# Altium project 2023无人机分电板V2.PrjPcb
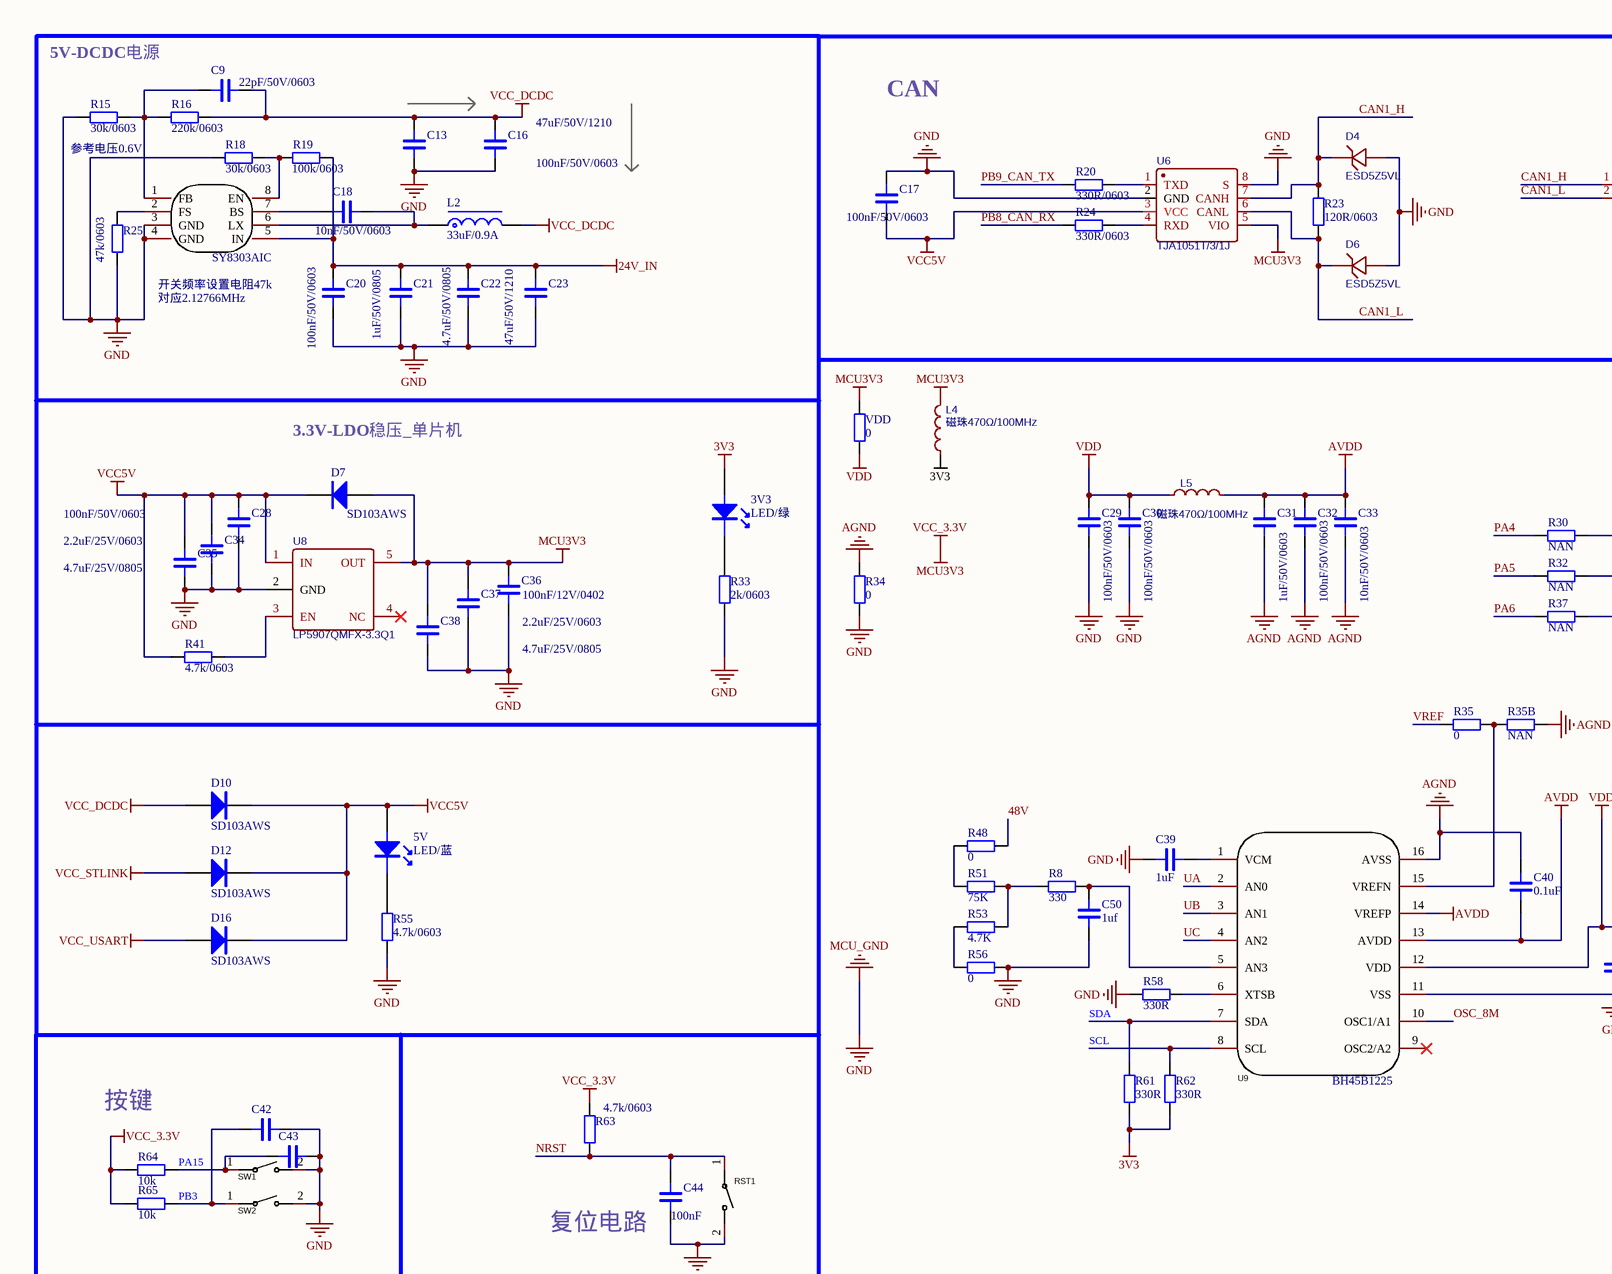
[diagram p0: MCU.SchDoc, top left]
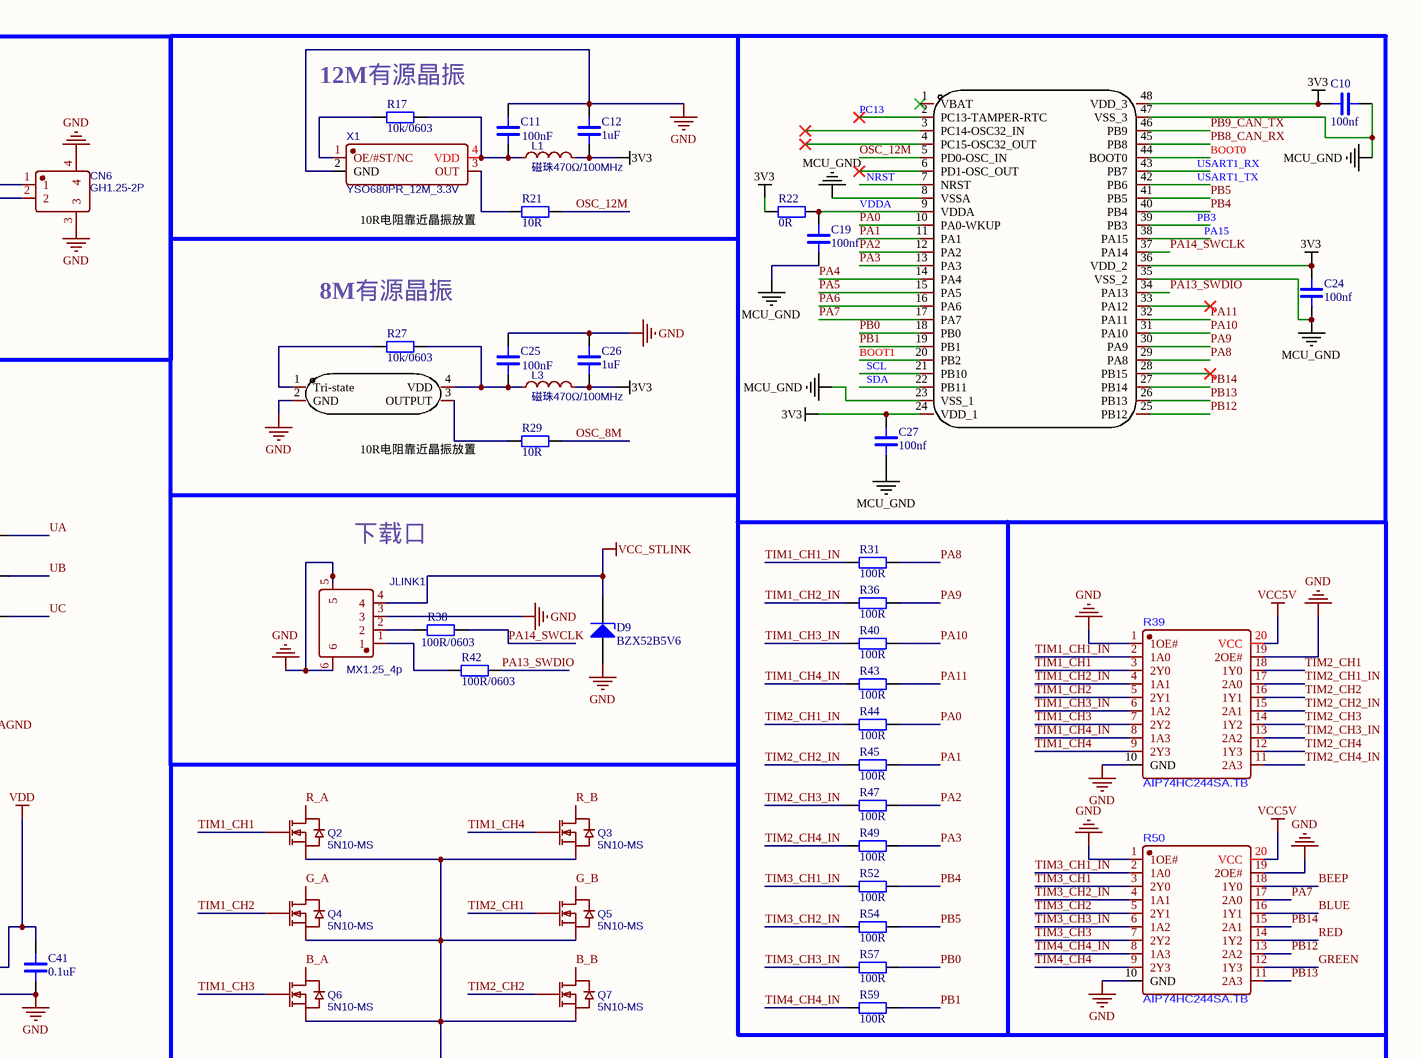
[diagram p1: MCU.SchDoc, top right]
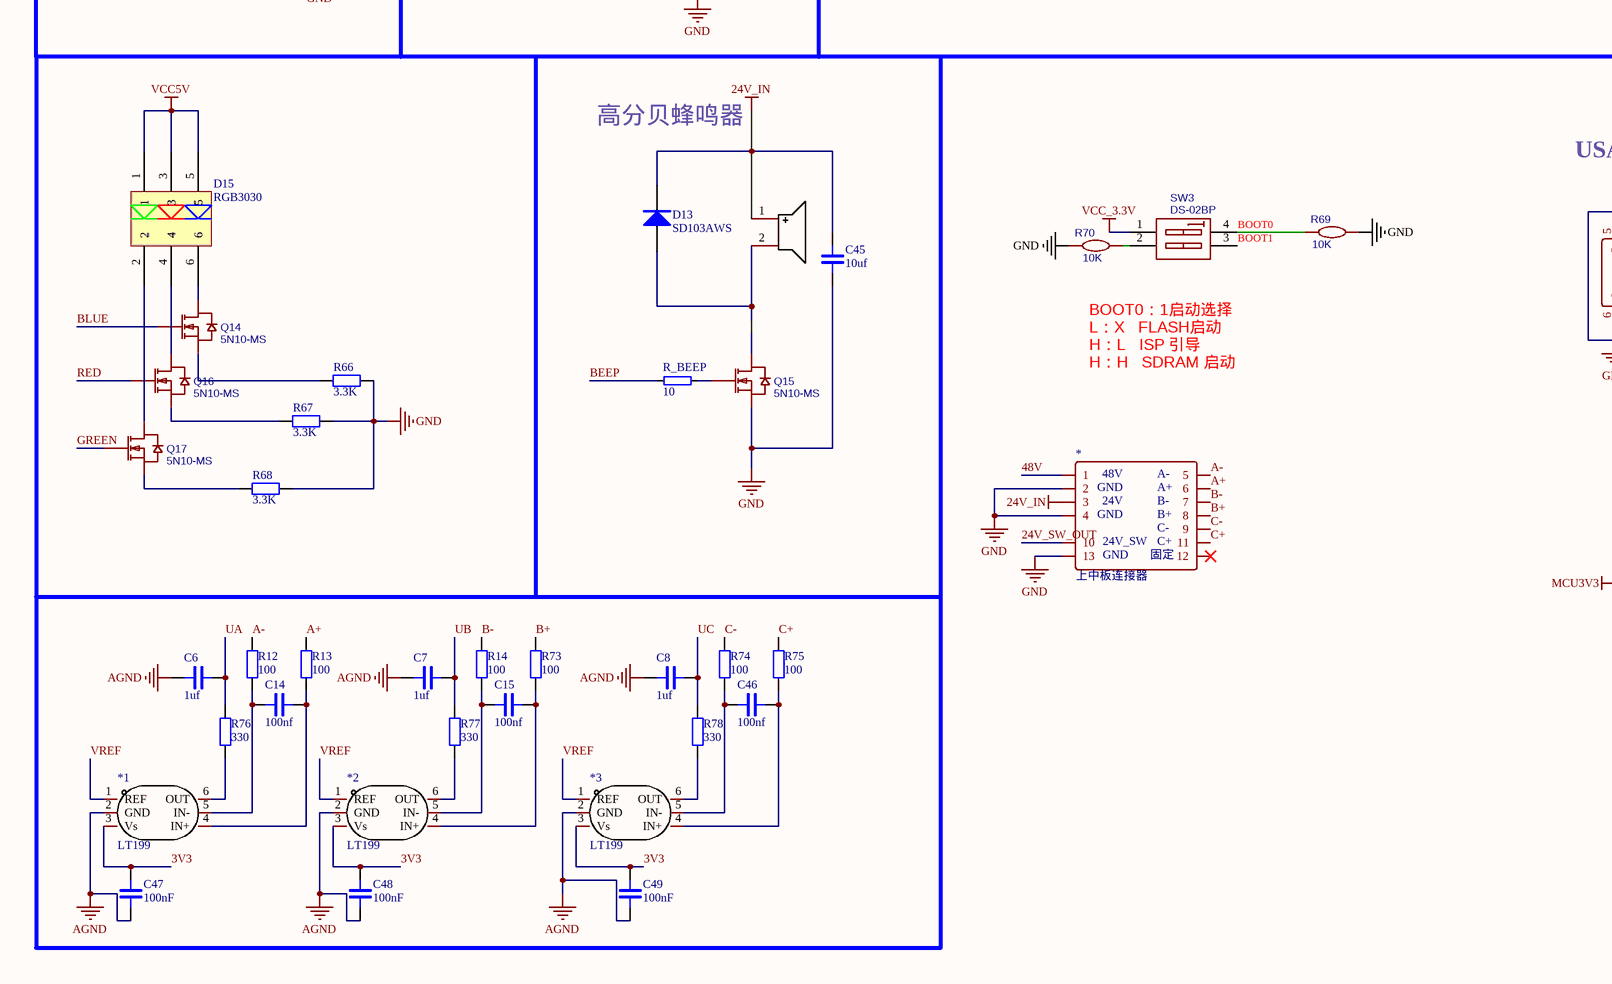
[diagram p2: MCU.SchDoc, bottom left]
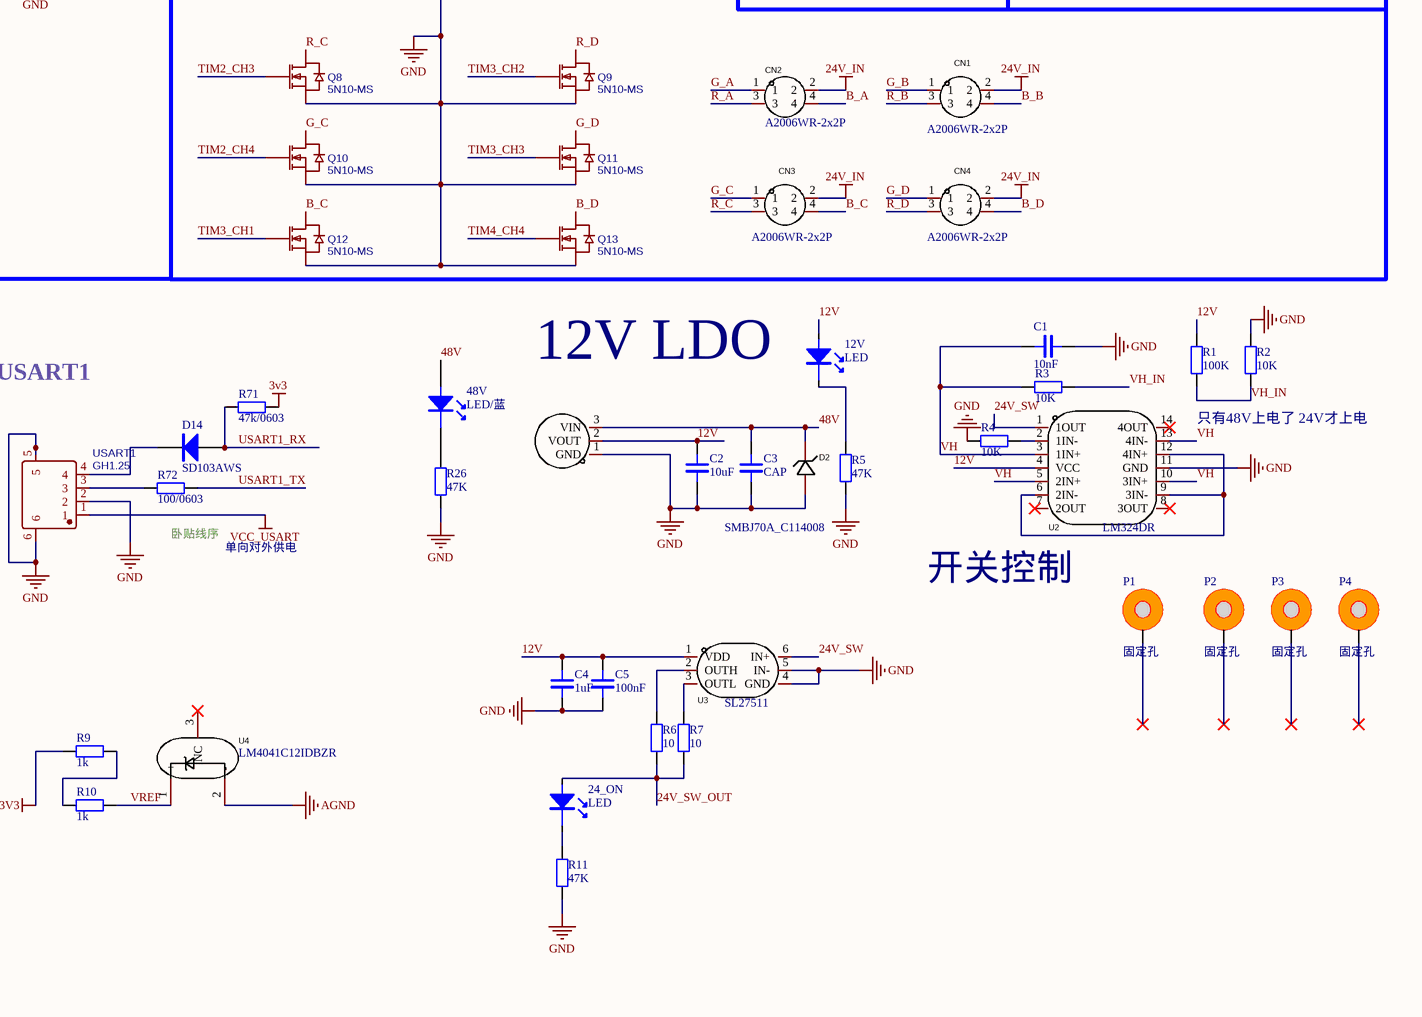
[diagram p3: MCU.SchDoc, bottom right]
1 sheet, 196 parts. Net scope: global (net labels, ports and power ports of the same name join across sheets).
Board file: 分电板V2.PcbDoc

## Sheet MCU.SchDoc
size A1

### Parts
3V3  LED/绿  [LED_0603]
5V  LED/蓝  [LED_0603]
12V  LED  [LED_0603]
24_ON  LED  [LED_0603]
48V  LED/蓝  [LED_0603]
*  上中板连接器  [上中板连接器]
*1  LT199  [SC70-6L]
*2  LT199  [SC70-6L]
*3  LT199  [SC70-6L]
BUZZER1  TMB12A12  [BUZ-TH_BD12.0-P7.60-D0.6-FD]  (value not drawn)
C1  10nF  [C 0603_L]
C2  10uF  [C 0603_L]
C3  CAP  [C 1210_L]
C4  1uF  [C 0603_L]
C5  100nF  [C 0603_L]
C6  1uf  [C 0603_L]
C7  1uf  [C 0603_L]
C8  1uf  [C 0603_L]
C9  22pF/50V/0603  [C 0603_L]
C10  100nf  [C 0603_L]
C11  100nF  [C 0603_L]
C12  1uF  [C 0603_L]
C13  47uF/50V/1210  [C 1210_L]
C14  100nf  [C 0603_L]
C15  100nf  [C 0603_L]
C16  100nF/50V/0603  [C 0603_L]
C17  100nF/50V/0603  [C 0603_L]
C18  10nF/50V/0603  [C 0603_L]
C19  100nf  [C 0603_L]
C20  100nF/50V/0603  [C 0603_L]
C21  1uF/50V/0805  [C 0805_L]
C22  4.7uF/50V/0805  [C 0805_L]
C23  47uF/50V/1210  [C 1210_L]
C24  100nf  [C 0603_L]
C25  100nF  [C 0603_L]
C26  1uF  [C 0603_L]
C27  100nf  [C 0603_L]
C28  100nF/50V/0603  [C 0603_L]
C29  100nF/50V/0603  [C 0603_L]
C30  100nF/50V/0603  [C 0603_L]
C31  1uF/50V/0603  [C 0603_L]
C32  100nF/50V/0603  [C 0603_L]
C33  10nF/50V/0603  [C 0603_L]
C34  2.2uF/25V/0603  [C 0603_L]
C35  4.7uF/25V/0805  [C 0805_L]
C36  100nF/12V/0402  [C 0603_L]
C37  2.2uF/25V/0603  [C 0603_L]
C38  4.7uF/25V/0805  [C 0805_L]
C39  1uF  [C 0603_L]
C40  0.1uF  [C 0603_L]
C41  0.1uF  [C 0603_L]
C42  100nF  [C 0603_L]  (value not drawn)
C43  100nF  [C 0603_L]  (value not drawn)
C44  100nF  [C 0603_L]
C45  10uf  [C 0805_L]
C46  100nf  [C 0603_L]
C47  100nF  [C 0603_L]
C48  100nF  [C 0603_L]
C49  100nF  [C 0603_L]
C50  1uf  [C 0603_L]
CN1  A2006WR-2x2P  [CONN-TH_A2006WR-2X2P]
CN2  A2006WR-2x2P  [CONN-TH_A2006WR-2X2P]
CN3  A2006WR-2x2P  [CONN-TH_A2006WR-2X2P]
CN4  A2006WR-2x2P  [CONN-TH_A2006WR-2X2P]
CN6  GH1.25-2P  [GH1.25-2P-LT]
D2  SMBJ70A_C114008  [SMB_L4.6-W3.6-LS5.3-RD]
D4  ESD5Z5VL  [SOD-523]
D6  ESD5Z5VL  [SOD-523]
D7  SD103AWS  [SOD-323]
D9  BZX52B5V6  [SOD-323]
D10  SD103AWS  [SOD-323]
D12  SD103AWS  [SOD-323]
D13  SD103AWS  [SOD-323]
D14  SD103AWS  [SOD-323]
D15  RGB3030  [LED-SMD_L3.0-W3.0_C9900015600]
D16  SD103AWS  [SOD-323]
JLINK1  MX1.25_4p  [MX1.25_4PIN]
L1  磁珠470Ω/100MHz  [L 0603]
L2  33uF/0.9A  [IND-SMD_L4.0-W4.0]
L3  磁珠470Ω/100MHz  [L 0603]
L4  磁珠470Ω/100MHz  [L 0603]
L5  磁珠470Ω/100MHz  [L 0603]
P1  固定孔  [固定孔]
P2  固定孔  [固定孔]
P3  固定孔  [固定孔]
P4  固定孔  [固定孔]
Q2  5N10-MS  [SOT23-3N]
Q3  5N10-MS  [SOT23-3N]
Q4  5N10-MS  [SOT23-3N]
Q5  5N10-MS  [SOT23-3N]
Q6  5N10-MS  [SOT23-3N]
Q7  5N10-MS  [SOT23-3N]
Q8  5N10-MS  [SOT23-3N]
Q9  5N10-MS  [SOT23-3N]
Q10  5N10-MS  [SOT23-3N]
Q11  5N10-MS  [SOT23-3N]
Q12  5N10-MS  [SOT23-3N]
Q13  5N10-MS  [SOT23-3N]
Q14  5N10-MS  [SOT23-3N]
Q15  5N10-MS  [SOT23-3N]
Q16  5N10-MS  [SOT23-3N]
Q17  5N10-MS  [SOT23-3N]
R1  100K  [R 0603_L]
R2  10K  [R 0603_L]
R3  10K  [R 0603_L]
R4  10K  [R 0603_L]
R5  47K  [R 0603_L]
R6  10  [R 0603_L]
R7  10  [R 0603_L]
R8  330  [R 0603_L]
R9  1k  [R 0603_L]
R10  1k  [R 0603_L]
R11  47K  [R 0603_L]
R12  100  [R 0603_L]
R13  100  [R 0603_L]
R14  100  [R 0603_L]
R15  30k/0603  [R 0603_L]
R16  220k/0603  [R 0603_L]
R17  10k/0603  [R 0603_L]
R18  30k/0603  [R 0603_L]
R19  100k/0603  [R 0603_L]
R20  330R/0603  [R 0603_L]
R21  10R  [R 0603_L]
R22  0R  [R 0603_L]
R23  120R/0603  [R 0603_L]
R24  330R/0603  [R 0603_L]
R25  47k/0603  [R 0603_L]
R26  47K  [R 0603_L]
R27  10k/0603  [R 0603_L]
R29  10R  [R 0603_L]
R30  NAN  [R 0603_L]
R31  100R  [R 0603_L]
R32  NAN  [R 0603_L]
R33  2k/0603  [R 0603_L]
R34  0  [R 0603_L]
R35  0  [R 0603_L]
R35B  NAN  [R 0603_L]
R36  100R  [R 0603_L]
R37  NAN  [R 0603_L]
R38  100R/0603  [R 0603_L]
R39  AIP74HC244SA.TB  [SOP-20_L12.7-W7.5-P1.27-LS10.2-BL]
R40  100R  [R 0603_L]
R41  4.7k/0603  [R 0603_L]
R42  100R/0603  [R 0603_L]
R43  100R  [R 0603_L]
R44  100R  [R 0603_L]
R45  100R  [R 0603_L]
R47  100R  [R 0603_L]
R48  0  [R 0603_L]
R49  100R  [R 0603_L]
R50  AIP74HC244SA.TB  [SOP-20_L12.7-W7.5-P1.27-LS10.2-BL]
R51  75K  [R 0603_L]
R52  100R  [R 0603_L]
R53  4.7K  [R 0603_L]
R54  100R  [R 0603_L]
R55  4.7k/0603  [R 0603_L]
R56  0  [R 0603_L]
R57  100R  [R 0603_L]
R58  330R  [R 0603_L]
R59  100R  [R 0603_L]
R61  330R  [R 0603_L]
R62  330R  [R 0603_L]
R63  4.7k/0603  [R 0603_L]
R64  10k  [R 0603_L]
R65  10k  [R 0603_L]
R66  3.3K  [R 0603_L]
R67  3.3K  [R 0603_L]
R68  3.3K  [R 0603_L]
R69  10K  [C 0603_L]
R70  10K  [C 0603_L]
R71  47k/0603  [R 0603_L]
R72  100/0603  [R 0603_L]
R73  100  [R 0603_L]
R74  100  [R 0603_L]
R75  100  [R 0603_L]
R76  330  [R 0603_L]
R77  330  [R 0603_L]
R78  330  [R 0603_L]
R_BEEP  10  [C 0603_L]
RST1  K2-1107ST-A4DW-06_C118141  [KEY-SMD_L6.2-W3.6-LS8.0 - duplicate]  (value not drawn)
SW1  K2-1107ST-A4DW-06_C118141  [KEY-SMD_L6.2-W3.6-LS8.0 - duplicate]  (value not drawn)
SW2  K2-1107ST-A4DW-06_C118141  [KEY-SMD_L6.2-W3.6-LS8.0 - duplicate]  (value not drawn)
SW3  DS-02BP  [SW-SMD_EM-02KP]
U1  ZXTR2112F-7  [SOT-23-3_L2.9-W1.6-P1.90-LS2.8-BR]  (value not drawn)
U2  LM324DR  [SOIC-14_L8.7-W3.9-P1.27-LS6.0-BL - duplicate]
U3  SL27511  [SOT-23-6_L2.9-W1.6-P0.95-LS2.8-BR]
U4  LM4041C12IDBZR  [SOT-23-3_L2.9-W1.6-P1.90-LS2.8-BR]
U5  STM32F103C8T6  [LQFP-48_L7.0-W7.0-P0.50-LS9.0-BL]  (value not drawn)
U6  TJA1051T/3/1J  [SOP8_L]
U7  SY8303AIC  [TSOT-23-8_L2.9-W1.6-P0.65-LS2.8-BR]
U8  LP5907QMFX-3.3Q1  [SOT23-5N]
U9  BH45B1225  [NSOP-16_L9.9-W3.9-P1.27-LS6.0-BL]
USART1  GH1.25  [GH1.25 4P-WT]
VDD  0  [R 0603_L]
X1  YSO680PR_12M_3.3V  [OSC 3225-4P]
X2  OT32258MJBA4SL  [OSC-SMD_4P-L3.2-W2.5-BL]  (value not drawn)

### Nets
3V3: 3V3.1 *1.3(Vs) *2.3(Vs) *3.3(Vs) C10.1 C12.2 C24.2 C26.2 C27.2 C47.2 C48.2 C49.2 L1.2 L3.2 L4.1 R22.1 R61.1 R62.1 R71.2 U5.24(VDD_1) U5.36(VDD_2) U5.48(VDD_3)
24V_IN: *.3 BUZZER1.1 C20.1 C21.1 C22.1 C23.1 C45.1 CN1.2 CN2.2 CN3.2 CN4.2 D13.2 R19.2 U7.5(IN)
AGND: *1.2(GND) *2.2(GND) *3.2(GND) C6.2 C7.2 C8.2 C31.2 C32.2 C33.2 C40.1 C47.1 C48.1 C49.1 R34.1 R35B.2 U4.2(-) U9.16(AVSS)
AVDD: C31.1 C32.1 C33.1 C40.2 L5.2 U9.13(AVDD) U9.14(VREFP)
GND: *.2 *.4 *.13 C1.1 C2.1 C3.2 C4.1 C5.1 C10.2 C11.1 C12.1 C13.2 C16.2 C17.1 C19.2 C20.2 C21.2 C22.2 C23.2 C24.1 C25.1 C26.1 C27.1 C28.2 C29.2 C30.2 C34.2 C35.2 C36.2 C37.2 C38.2 C39.1 C41.2 C42.2 C43.2 C44.2 C45.2 C50.2 CN6.3 CN6.4 D2.2(A) D4.1(A) D6.1(A) D9.1(A) JLINK1.3 JLINK1.5 JLINK1.6 Q2.2(S) Q3.2(S) Q4.2(S) Q5.2(S) Q6.2(S) Q7.2(S) Q8.2(S) Q9.2(S) Q10.2(S) Q11.2(S) Q12.2(S) Q13.2(S) Q15.2(S) R2.2 R4.1 R5.1 R11.1 R15.1 R18.1 R25.2 R26.1 R33.2 R34.2 R39.1(1OE#) R39.10(GND) R39.19(2OE#) R50.1(1OE#) R50.10(GND) R50.19(2OE#) R55.2 R56.2 R58.1 R66.1 R67.1 R68.1 R69.1 R70.2 RST1.2 SW1.2 SW2.2 U1.1(GND) U2.11(GND) U3.4(GND) U3.5(IN-) U5.8(VSSA) U5.23(VSS_1) U5.35(VSS_2) U5.47(VSS_3) U6.2(GND) U6.8(S) U7.3(GND) U7.4(GND) U8.2(GND) U9.11(VSS) USART1.2 USART1.5 USART1.6 X1.2(GND) X2.2(GND)  [also labelled MCU_GND]
MCU3V3: C36.1 C37.1 C38.1 D7.1 L4.2 R9.1 R63.1 R64.2 R65.2 SW3.1(A1) U6.5(VIO) U8.5(OUT) VDD.1  [also labelled VCC_3.3V]
VCC5V: 5V.1 C17.2 C28.1 C34.1 C35.1 D7.2 D10.2 D12.2 D15.1 D15.3 D15.5 D16.2 R39.20(VCC) R41.1 R50.20(VCC) U6.3(VCC) U8.1(IN)
VCC_DCDC: C9.1 C13.1 C16.1 D10.1 L2.2 R16.2
VCC_STLINK: D9.2(K) D12.1 JLINK1.4
VCC_USART: D16.1 USART1.1
VDD: C29.1 C30.1 C41.1 L5.1 U9.12(VDD) VDD.2
12V: 12V.1 C2.2 C4.2 C5.2 R1.1 U1.2(VOUT) U2.4(VCC) U3.1(VDD)
24V_SW: U2.1(1OUT) U3.6(IN+)
24V_SW_OUT: 24_ON.1 *.10 R6.1 R7.1
48V: 48V.1 *.1 C3.1 D2.1(C) R48.2 U1.3(VIN)
A+: *.6 R13.2
A-: *.5 R12.2
B+: *.8 R73.2
B-: *.7 R14.2
B_A: CN2.4 Q6.3(D)
B_B: CN1.4 Q7.3(D)
B_C: CN3.4 Q12.3(D)
B_D: CN4.4 Q13.3(D)
BEEP: R50.18(1Y0) R_BEEP.1
BLUE: Q14.1(G) R50.16(1Y1)
BOOT0: R69.2 SW3.4(B3) U5.44(BOOT0)
BOOT1: SW3.3(A3) U5.20(PB2)
C+: *.11 R75.2
C-: *.9 R74.2
CAN1_H: CN6.1 D4.2(C) R23.2 U6.7(CANH)
CAN1_L: CN6.2 D6.2(C) R23.1 U6.6(CANL)
G_A: CN2.1 Q4.3(D)
G_B: CN1.1 Q5.3(D)
G_C: CN3.1 Q10.3(D)
G_D: CN4.1 Q11.3(D)
GREEN: Q17.1(G) R50.12(1Y3)
NRST: C44.1 R63.2 RST1.1 U5.7(NRST)
OSC_8M: R29.2 U9.10(OSC1/A1)
OSC_12M: R21.2 U5.5(PD0-OSC_IN)
PA0: R44.1 U5.10(PA0-WKUP)
PA1: R45.1 U5.11(PA1)
PA2: R47.1 U5.12(PA2)
PA3: R49.1 U5.13(PA3)
PA4: R30.1 U5.14(PA4)
PA5: R32.1 U5.15(PA5)
PA6: R37.1 U5.16(PA6)
PA7: R50.17(2A0) U5.17(PA7)
PA8: R31.1 U5.29(PA8)
PA9: R36.1 U5.30(PA9)
PA10: R40.1 U5.31(PA10)
PA11: R43.1 U5.32(PA11)
PA13_SWDIO: R42.1 U5.34(PA13)
PA14_SWCLK: R38.1 U5.37(PA14)
PA15: C43.1 R64.1 SW1.1 U5.38(PA15)
PB0: R57.1 U5.18(PB0)
PB1: R59.1 U5.19(PB1)
PB3: C42.1 R65.1 SW2.1 U5.39(PB3)
PB4: R52.1 U5.40(PB4)
PB5: R54.1 U5.41(PB5)
PB8_CAN_RX: R24.1 U5.45(PB8)
PB9_CAN_TX: R20.1 U5.46(PB9)
PB12: R50.13(2A2) U5.25(PB12)
PB13: R50.11(2A3) U5.26(PB13)
PB14: R50.15(2A1) U5.27(PB14)
PC13: U5.2(PC13-TAMPER-RTC)
R_A: CN2.3 Q2.3(D)
R_B: CN1.3 Q3.3(D)
R_C: CN3.3 Q8.3(D)
R_D: CN4.3 Q9.3(D)
RED: Q16.1(G) R50.14(1Y2)
SCL: R62.2 U5.21(PB10) U9.8(SCL)
SDA: R61.2 U5.22(PB11) U9.7(SDA)
TIM1_CH1: Q2.1(G) R39.3(2Y0)
TIM1_CH1_IN: R31.2 R39.2(1A0)
TIM1_CH2: Q4.1(G) R39.5(2Y1)
TIM1_CH2_IN: R36.2 R39.4(1A1)
TIM1_CH3: Q6.1(G) R39.7(2Y2)
TIM1_CH3_IN: R39.6(1A2) R40.2
TIM1_CH4: Q3.1(G) R39.9(2Y3)
TIM1_CH4_IN: R39.8(1A3) R43.2
TIM2_CH1: Q5.1(G) R39.18(1Y0)
TIM2_CH1_IN: R39.17(2A0) R44.2
TIM2_CH2: Q7.1(G) R39.16(1Y1)
TIM2_CH2_IN: R39.15(2A1) R45.2
TIM2_CH3: Q8.1(G) R39.14(1Y2)
TIM2_CH3_IN: R39.13(2A2) R47.2
TIM2_CH4: Q10.1(G) R39.12(1Y3)
TIM2_CH4_IN: R39.11(2A3) R49.2
TIM3_CH1: Q12.1(G) R50.3(2Y0)
TIM3_CH1_IN: R50.2(1A0) R52.2
TIM3_CH2: Q9.1(G) R50.5(2Y1)
TIM3_CH2_IN: R50.4(1A1) R54.2
TIM3_CH3: Q11.1(G) R50.7(2Y2)
TIM3_CH3_IN: R50.6(1A2) R57.2
TIM4_CH4: Q13.1(G) R50.9(2Y3)
TIM4_CH4_IN: R50.8(1A3) R59.2
UA: C6.1 R30.2 R76.2 U9.2(AN0)
UB: C7.1 R32.2 R77.2 U9.3(AN1)
UC: C8.1 R37.2 R78.2 U9.4(AN2)
USART1_RX: D14.1 R71.1 U5.43(PB7)
USART1_TX: R72.2 U5.42(PB6)
VDDA: C19.1 R22.2 U5.9(VDDA)
VH: C1.2 R3.2 U2.3(1IN+) U2.5(2IN+) U2.10(3IN+) U2.13(4IN-)
VH_IN: R1.2 R2.1 R3.1
VREF: *1.1(REF) *2.1(REF) *3.1(REF) R10.2 R35.1 U4.1(+)
Net3V3_2: 3V3.2 R33.1
Net5V_2: 5V.2 R55.1
Net12V_2: 12V.2 R5.2
Net24_ON_2: 24_ON.2 R11.2
Net48V_2: 48V.2 R26.2
Net*1_4: *1.4(IN+) C14.1 R13.1
Net*1_5: *1.5(IN-) C14.2 R12.1
Net*1_6: *1.6(OUT) R76.1
Net*2_4: *2.4(IN+) C15.1 R73.1
Net*2_5: *2.5(IN-) C15.2 R14.1
Net*2_6: *2.6(OUT) R77.1
Net*3_4: *3.4(IN+) C46.1 R75.1
Net*3_5: *3.5(IN-) C46.2 R74.1
Net*3_6: *3.6(OUT) R78.1
NetBUZZER1_2: BUZZER1.2 D13.1 Q15.3(D)
NetC9_2: C9.2 R15.2 R16.1 U7.1(FB)
NetC11_2: C11.2 L1.1 R17.2 X1.4(VDD)
NetC18_1: C18.1 L2.1 U7.6(LX)
NetC18_2: C18.2 U7.7(BS)
NetC25_2: C25.2 L3.1 R27.2 X2.4(VDD)
NetC39_2: C39.2 U9.1(VCM)
NetC50_1: C50.1 R8.1 U9.5(AN3)
NetD14_2: D14.2 USART1.4
NetD15_2: D15.2 Q17.3(D)
NetD15_4: D15.4 Q16.3(D)
NetD15_6: D15.6 Q14.3(D)
NetJLINK1_1: JLINK1.1 R42.2
NetJLINK1_2: JLINK1.2 R38.2
NetQ14_2: Q14.2(S) R66.2
NetQ15_1: Q15.1(G) R_BEEP.2
NetQ16_2: Q16.2(S) R67.2
NetQ17_2: Q17.2(S) R68.2
NetR4_2: R4.2 U2.2(1IN-)
NetR6_2: R6.2 U3.2(OUTH)
NetR7_2: R7.2 U3.3(OUTL)
NetR8_2: R8.2 R51.2 R53.2
NetR9_2: R9.2 R10.1
NetR17_1: R17.1 X1.1(OE/#ST/NC)
NetR18_2: R18.2 R19.1 U7.8(EN)
NetR20_2: R20.2 U6.1(TXD)
NetR21_1: R21.1 X1.3(OUT)
NetR24_2: R24.2 U6.4(RXD)
NetR25_1: R25.1 U7.2(FS)
NetR27_1: R27.1 X2.1(Tri-state)
NetR29_1: R29.1 X2.3(OUTPUT)
NetR35_2: R35.2 R35B.1 U9.15(VREFN)
NetR41_2: R41.2 U8.3(EN)
NetR48_1: R48.1 R51.1
NetR53_1: R53.1 R56.1
NetR58_2: R58.2 U9.6(XTSB)
NetR70_1: R70.1 SW3.2(A2)
NetR72_1: R72.1 USART1.3
NetU2_6: U2.6(2IN-) U2.9(3IN-) U2.12(4IN+)

Not connected (* = marked no-connect by the designer): * 12*; P1 1*; P2 1*; P3 1*; P4 1*; U2 7(2OUT)* 8(3OUT)* 14(4OUT)*; U4 3(NC)*; U5 1(VBAT)* 3(PC14-OSC32_IN)* 4(PC15-OSC32_OUT)* 6(PD1-OSC_OUT)* 28(PB15)* 33(PA12)*; U8 4(NC)*; U9 9(OSC2/A2)*

### Notes on the sheet
- 5V-DCDC电源
- CAN
- (near R17) 12M有源晶振
- (near R15) 参考电压0.6V
- (near D4) MANIFOLD 2-G
- 10R电阻靠近晶振放置
- 开关频率设置电阻47k
- 对应2.12766MHz
- (near R27) 8M有源晶振
- 3.3V-LDO稳压_单片机
- (near JLINK1) 下载口
- 按键
- 复位电路
- 高分贝蜂鸣器
- USART1
- 12V LDO
- 只有48V上电了 24V才上电
- BOOT0：1启动选择
  L：X   FLASH启动
  H：L   ISP 引导
  H：H   SDRAM 启动
- (near R72) 卧贴线序
- 单向对外供电
- 开关控制
- (in symbol 上中板连接器) 48V; A-; GND; A+; 24V; B-; B+; C-; 24V_SW; C+; 固定

### Library data of the parts
3V3 5V 12V 24_ON 48V = LED: 发光二极管
*1-*3 = LT199: 双向、零漂移电流感应放大器
BUZZER1 = TMB12A12: Manufacturer: YUEXIN(悦馨); Name: 2400Hz; Symbol: TMB12A12_C781861; Add into BOM: yes; Oscillator Circuit: 有源(内含驱动线路); Technology Type: 电磁式; Rated Voltage: 12V; Operating Voltage: 8V~15V; Current Consumption: 30mA; Value: 2400Hz; Sound Pressure Level (SPL): 88dB@10cm; Device: TMB12A12; LCSC Part Name: 有源电磁式蜂鸣器; Supplier Part: C781861; Manufacturer Part: TMB12A12; Supplier Footprint: 插件,D=12mm; JLCPCB Part Class: Extended Part; Datasheet: https://atta.szlcsc.com/upload/public/pdf/source/20200927/C781859_CEC7B7F6A9D62F380D126441DF0F265C.pdf; Supplier: LCSC; Convert to PCB: yes; Diameter (φD): 12mm; Length: -; Width: -; Height: 9.5mm; Operating Temperature: -30℃~+85℃
C1-C10 C13-C24 C27 C29-C33 C35 C36 C38 C45-C50 = CAP: 陶瓷电容
C11 C12 C25 C26 C28 C34 C37 C39-C44 = CAP: Capacitor
CN1-CN4 = A2006WR-2x2P: Manufacturer: CJT(长江连接器); Symbol: A2006WR-2X2P_C273077; Add into BOM: yes; Reference Series: PH; Pitch: 2mm; Pins Structure: 2x2P; Number of PINs Per Row: 2; Name: A2006WR-2x2P; Device: A2006WR-2x2P; LCSC Part Name: PH 2mm 2x2P 镀锡; Supplier Part: C273077; Manufacturer Part: A2006WR-2x2P; Supplier Footprint: 弯插,P=2mm; JLCPCB Part Class: Extended Part; Datasheet: https://atta.szlcsc.com/upload/public/pdf/source/20180913/C273077_48101FEEEEEA06DA8F558152F6E7ED54.pdf; Supplier: LCSC; Convert to PCB: yes; Number of Rows: 2; Row Spacing: 2mm; Mounting Style: -; Contact Material: 黄铜
CN6 = GH1.25-2P: 连接端子; BOM_Manufacturer: Changjiang Connectors; BOM_Manufacturer Part: A1257WR-S-2P; Contributor: LCSC; BOM_Supplier: LCSC; BOM_Supplier Part: C225125; spicePre: C; spiceSymbolName: A1257WR-S-2P
D2 = SMBJ70A_C114008: Manufacturer: MDD; Add into BOM: yes; Polarity: 单向; Reverse Stand-Off Voltage (Vrwm): 70V; Breakdown Voltage: 77.8V; Peak Pulse Current (Ipp)@10/1000μs: 5.3A; Maximum Clamping Voltage: 113V; Name: SMBJ70A; Symbol: SMBJ70A; Device: SMBJ70A_C114008; LCSC Part Name: 单向TVS 70V截止 5.3A峰值脉冲; Supplier Part: C114008; Manufacturer Part: SMBJ70A; Supplier Footprint: SMB(DO-214AA); JLCPCB Part Class: Extended Part; Datasheet: https://atta.szlcsc.com/upload/public/pdf/source/20230314/C8F66EF07395B88C11214ABD10019202.pdf; Supplier: LCSC; Convert to PCB: yes
D4 D6 = ESD5Z5VL: ESD 单向 5V; BOM_Manufacturer: MDD; BOM_Manufacturer Part: SMF6.5A; Contributor: LCSC; BOM_Supplier: LCSC; BOM_Supplier Part: C123792; BOM_JLCPCB Part Class: Extended Part; spicePre: D; spiceSymbolName: SMF6.5A
D7 D10 D12-D14 D16 = SD103AWS: 二极管
D9 = BZX52B5V6: 稳压二极管
JLINK1 = MX1.25_4p: 连接端子; BOM_Manufacturer: Changjiang Connectors; BOM_Manufacturer Part: A1257WR-S-4P; Contributor: LCSC; BOM_Supplier: LCSC; BOM_Supplier Part: C225127; spicePre: C; spiceSymbolName: A1257WR-S-4P
L1 L3-L5 = 磁珠470Ω: BOM_Manufacturer: Sunlord; BOM_Manufacturer Part: UPZ1608U471-1R5TF; nameAlias: Value; BOM_Supplier: LCSC; BOM_Supplier Part: C74335; spicePre: L; spiceSymbolName: UPZ1608U471-1R5TF
L2 = L-SMDP: 贴片功率电感; BOM名称: 功率电感
Q2-Q17 = YJL3400A: BOM_Manufacturer: Yangzhou Yangjie Elec Tech; Contributor: LCSC; BOM_Supplier: LCSC; BOM_Supplier Part: C699302; BOM_Manufacturer Part: YJL3400A; BOM_JLCPCB Part Class: Extended Part; spicePre: Q; spiceSymbolName: YJL3400A
R1-R27 R29-R35 R35B R36-R38 R40-R45 R47-R49 R51-R59 R61-R68 R71-R78 VDD = RES: 贴片电阻
R69 R70 = 10K: BOM_Manufacturer: UniOhm; BOM_Manufacturer Part: 0805W8F0000T5E; nameAlias: Resistance (Ohms); SMT Type: Basic; BOM_Supplier: LCSC; BOM_LCSC Assembly: Yes; BOM_Supplier Part: C17477; spicePre: R; spiceSymbolName: 0805W8F0000T5E
R_BEEP = RES
RST1 SW1 SW2 = K2-1107ST-A4DW-06_C118141: Manufacturer: 韩国韩荣; Symbol: K2-1107ST-A4SW-06; Add into BOM: yes; Contact Current: 50mA; Voltage Rating (DC): 12V; Insulation Resistance: 100MΩ; Circuit: 单刀单掷; Actuator Style: 矩形按钮; Operating Force: 250gf@±30gf; Mechanical Life: 100000; Switch Length: 6.1mm; Switch Width: 3.6mm; Switch Height: 2.5mm; Name: K2-1107ST-A4DW-06; Device: K2-1107ST-A4DW-06_C118141; LCSC Part Name: 轻触开关 3.6*6.1*2.5; Supplier Part: C118141; Manufacturer Part: K2-1107ST-A4DW-06; Supplier Footprint: SMD; JLCPCB Part Class: Extended Part; Datasheet: https://atta.szlcsc.com/upload/public/pdf/source/20210810/381712CEF248770C072B585C3485C888.pdf; Supplier: LCSC; Convert to PCB: yes; Mounting Style: 立贴; With Lamp: -; Operating Temperature: -25℃~+85℃
SW3 = DS-02BP: BOM_Manufacturer: HRO; Contributor: LCSC; BOM_Supplier: LCSC; BOM_Manufacturer Part: DS-02BP; BOM_Supplier Part: C129068; spicePre: S; spiceSymbolName: DS-02BP
U1 = ZXTR2112F-7: Manufacturer: DIODES(美台); Add into BOM: yes; Output Type: 固定; Output Polarity: 正; Number of Outputs: 1; Maximum Input Voltage: 60V; Output Voltage: 12V; Output Current: 50mA; Power Supply Rejection Ratio (PSRR): 50dB@(100Hz); Name: ZXTR2112F-7; Symbol: ZXTR2112F-7; Device: ZXTR2112F-7; LCSC Part Name: 正 Vin=60V Vout=12V 50mA 50dB@(100Hz); Supplier Part: C441831; Manufacturer Part: ZXTR2112F-7; Supplier Footprint: SOT-23; JLCPCB Part Class: Extended Part; Datasheet: https://atta.szlcsc.com/upload/public/pdf/source/20191028/C441831_30B6D71C82CD52B81E1403E5F67B24E2.pdf; Supplier: LCSC; Convert to PCB: yes; Dropout Voltage: -
U2 = LM324DR: Manufacturer: TI(德州仪器); Add into BOM: yes; Amplifier Type: General Purpose; Number of Circuits: 4; Gain Bandwidth Product（GBP）: 1.2MHz; Slew Rate（SR）: 0.5 V/us; Supply Voltage（Single）: 3V ~ 32V, ±1.5V ~ 16V; Iq per channel (Typ): 1.4mA; Name: LM324DR; Symbol: LM324DR; Device: LM324DR; LCSC Part Name: LM324DR; Supplier Part: C7943; Manufacturer Part: LM324DR; Supplier Footprint: SOIC-14; JLCPCB Part Class: Extended Part; Datasheet: https://atta.szlcsc.com/upload/public/pdf/source/20140704/1457707114488.pdf; Supplier: LCSC; Convert to PCB: yes; Output Type: -; Operating Temperature: 0°C ~ 70°C
U3 = SL27511: Manufacturer: Slkor(萨科微); Add into BOM: yes; Driven Configuration: 低边; Number of Drivers: 1; loadtype: MOSFET；IGBT; Whether the isolation: 非隔离; Supply Voltage: 4.5V~20V; Peak Output Current(sink): 8A; Peak Output Current(source): 4A; Rise Time: 6ns; Fall Time: 4.5ns; Propagation Delay tpLH: 16ns; Name: SL27511; Symbol: SL27511; Device: SL27511; LCSC Part Name: 低边 IGBT MOSFET 灌:8A 拉:4A; Supplier Part: C2681373; Manufacturer Part: SL27511; Supplier Footprint: SOT-23-6; JLCPCB Part Class: Extended Part; Datasheet: https://atta.szlcsc.com/upload/public/pdf/source/20210108/C2681373_CD41C44CDBB9248B0528B6216F344054.pdf; Supplier: LCSC; Convert to PCB: yes; Propagation Delay tpHL: 16ns; Feature: 欠压保护(UVP); Operating Temperature: -40℃~+125℃@(Ta)
U4 = LM4041C12IDBZR: 1.225V; Manufacturer: TI(德州仪器); Add into BOM: yes; Reference Type: 并联; Output Type: 固定; Output Current: 12mA; Tolerance: ±0.5%; Temperature Coefficient: 100ppm/℃; Minimum Cathode Current for Regulation: 80uA; Noise - 10Hz to 10kHz: 20uVrms; Name: LM4041C12IDBZR; Symbol: LM4041C12IDBZR; Device: LM4041C12IDBZR; LCSC Part Name: 并联 1.225V 12mA; Supplier Part: C133587; Manufacturer Part: LM4041C12IDBZR; Supplier Footprint: SOT-23; JLCPCB Part Class: Extended Part; Datasheet: https://atta.szlcsc.com/upload/public/pdf/source/20170930/C133587_1506736441908997434.pdf; Supplier: LCSC; Convert to PCB: yes; Input Voltage: -; Output Voltage: 1.225V; Supply Current: -; Noise - 1/10Hz to 10Hz: -; Operating Temperature: -40℃~+85℃@(Ta)
U5 = STM32F103C8T6: Manufacturer: ST(意法半导体); Add into BOM: yes; CPU Core: ARM Cortex-M3; CPU Maximum Speed: 72MHz; Operating Voltage Range: 2V~3.6V; Program Storage Size: 64KB; Program Memory Type: FLASH; RAM Size: 20KB; GPIO Ports Number: 37; ADC (Bit): 12bit; Peripheral/Function: 看门狗；DMA；看门狗；片载温度传感器; Internal Oscillator: 有; Name: STM32F103C8T6; Symbol: STM32F103C8T6; Device: STM32F103C8T6; LCSC Part Name: ARM Cortex-M3 72MHz MSL=3; Supplier Part: C8734; Manufacturer Part: STM32F103C8T6; Supplier Footprint: LQFP-48(7x7); JLCPCB Part Class: Basic Part; Datasheet: https://atta.szlcsc.com/upload/public/pdf/source/20220812/8363ACEC51AD55ECEB84799464F7CB85.pdf; Supplier: LCSC; Convert to PCB: yes; EEPROM: 64KB; DAC (Bit): -; PWM (Bit): -; Universal Serial Bus: -; Internal Comparator: -; communication protocol: -; Watchdog: -; Real-Time Clock: -; Infrared Data Association: -; Low-Voltage Detect: -; CCP Capture/Compare: -; Secure Digital Input and Output: -; Direct Memory Access: -; Operating Temperature Range: -40℃~+85℃
U6 = TJA1051T/3/1J: CAN芯片; BOM_Manufacturer: NXP; BOM_Supplier: LCSC; BOM_Manufacturer Part: TJA1051T/3/1J; BOM_Supplier Part: C38695; BOM_JLCPCB Part Class: Extended Part; spicePre: U; spiceSymbolName: TJA1051T/3/1J
U7 = SY8303AIC: DCDC ADJ 3A; Manufacturer: 矽力杰silergy; Add into BOM: yes; Function: 降压型; Name: SY8303AIC; Symbol: SY8303AIC; Device: SY8303AIC; LCSC Part Name: 降压型; Supplier Part: C97054; Manufacturer Part: SY8303AIC; Supplier Footprint: TSOT-23-8; JLCPCB Part Class: Extended Part; Datasheet: https://atta.szlcsc.com/upload/public/pdf/source/20170308/1488958431714.pdf; Supplier: LCSC; Convert to PCB: yes; Synchronous Rectification: -; Number of Outputs: -; Topology: -; Input Voltage: -; Output Current (Max): -; Switching Frequency: -
U8 = LP5907QMFX-3.3Q1: BOM_Manufacturer: TI; Contributor: LCSC; SMT Type: Extend; BOM_Supplier: LCSC; BOM_Manufacturer Part: LP5907QMFX-3.3Q1; BOM_Supplier Part: C130005; BOM_JLCPCB SMD: Yes; spicePre: U; spiceSymbolName: LP5907QMFX-3.3Q1
U9 = BH45B1225: 内建可编程增益放大器的多通道24-bit的Delta Sigma A/D转换器; Manufacturer: TM(天微); Name: TM7705; Symbol: TM7705_C77545; Add into BOM: yes; Device: TM7705_C77545; LCSC Part Name: TM7705  窄体; Supplier Part: C77545; Manufacturer Part: TM7705; Supplier Footprint: SOIC-16; JLCPCB Part Class: Extended Part; Datasheet: https://atta.szlcsc.com/upload/public/pdf/source/20160706/1467801115498.pdf; Supplier: LCSC; Convert to PCB: yes
USART1 = GH1.25 4p: 连接端子; BOM_Manufacturer: Changjiang Connectors; BOM_Manufacturer Part: A1257WR-S-4P; Contributor: LCSC; BOM_Supplier: LCSC; BOM_Supplier Part: C225127; spicePre: C; spiceSymbolName: A1257WR-S-4P
X1 = YSO680PR_12M_3.3V: 有源晶振12M; BOM_Manufacturer: Yangxing Tech; BOM_Manufacturer Part: OP322512MEDA4SI-u; nameAlias: Frequency; Contributor: LCSC; BOM_Supplier: LCSC; BOM_Supplier Part: C382483; spicePre: X; spiceSymbolName: OP322512MEDA4SI-U
X2 = OT32258MJBA4SL: Manufacturer: YXC(扬兴晶振); Name: 8MHz; Add into BOM: yes; Value: 8MHz; Frequency Stability: ±10ppm; Supply Voltage: 1.8V~3.3V; Symbol: OT32258MJBA4SL; Device: OT32258MJBA4SL; LCSC Part Name: 8MHz ±10ppm 1.8V~3.3V; Supplier Part: C717687; Manufacturer Part: OT32258MJBA4SL; Supplier Footprint: SMD3225-4P; JLCPCB Part Class: Extended Part; Datasheet: https://atta.szlcsc.com/upload/public/pdf/source/20210329/C669065_30B18CFE780D377BA4E84F6ED1951959.pdf; Supplier: LCSC; Convert to PCB: yes; Operating Temperature: -40℃~+85℃